# Altium schematic sheet ALTIUM_Sheet_1_2020-07-05_01-04-44.schdoc
size 277 x 198 mm
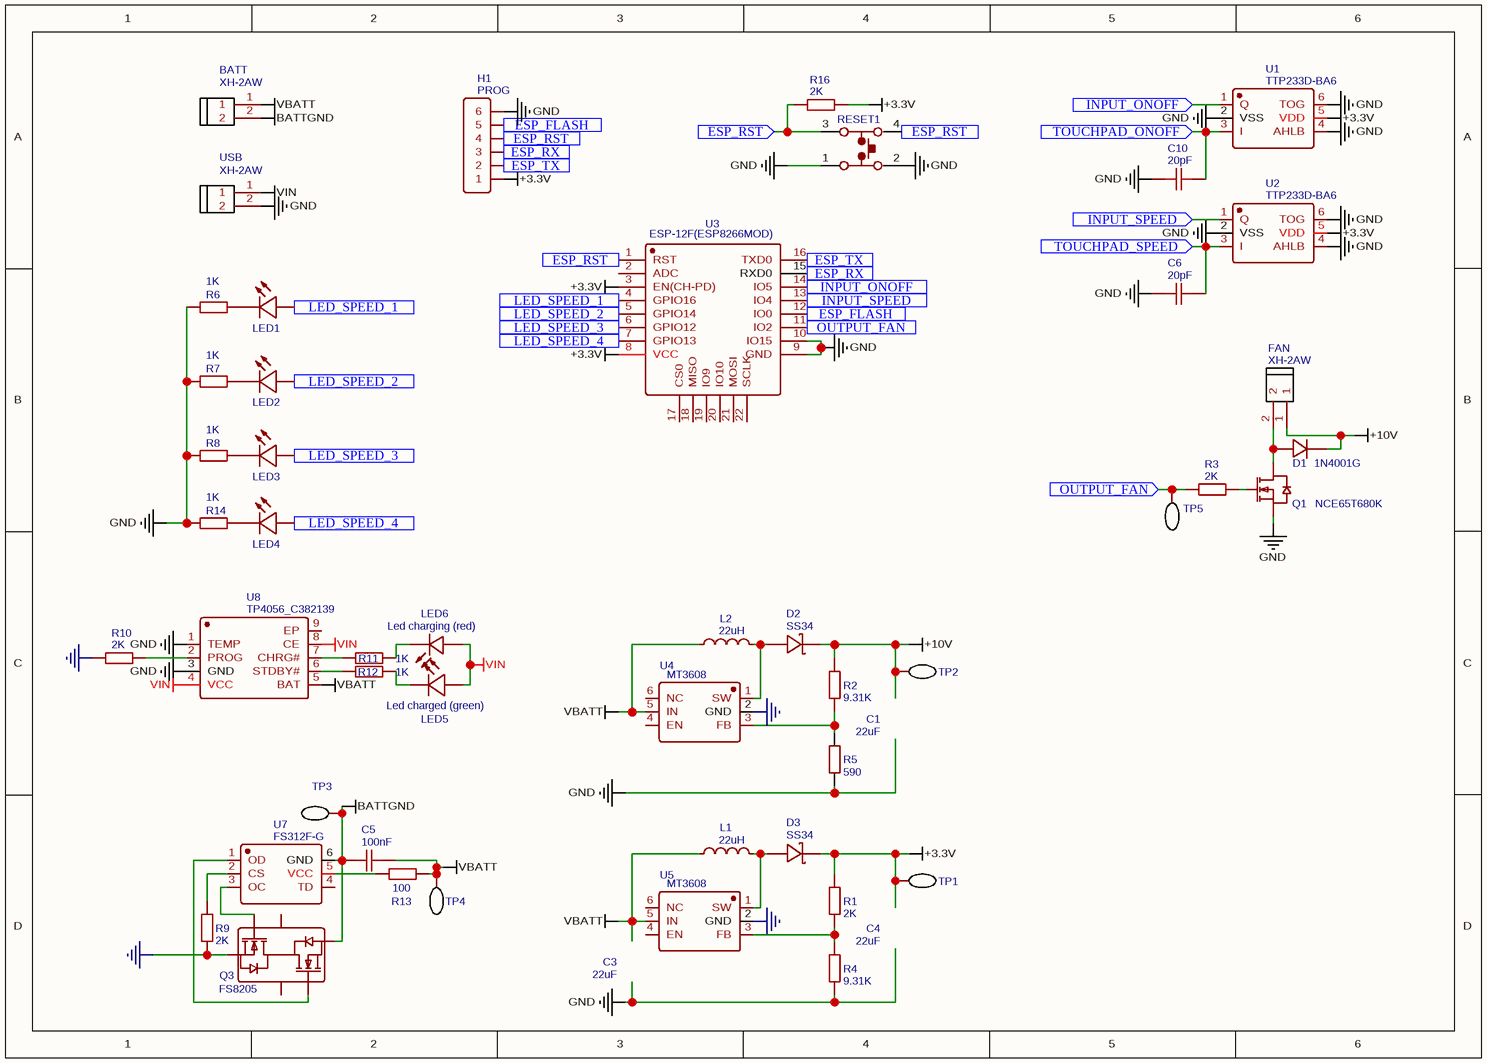
[diagram p0: ALTIUM_Sheet_1_2020-07-05_01-04-44.schdoc]

## Parts
BATT  XH-2AW  [CONN-TH_2P-P2.50_XH-2AW]
C1  22uF  [1812]
C3  22uF  [1812]
C4  22uF  [1812]
C5  100nF  [C0805]
C6  20pF  [C0603]
C10  20pF  [C0603]
D1  1N4001G  [SMA_L4.4-W2.6-LS5.0-RD]
D2  SS34  [SMA(DO-214AC)]
D3  SS34  [SMA(DO-214AC)]
FAN  XH-2AW  [CONN-TH_2P-P2.50_XH-2AW]
H1  PROG  [HDR-TH_6P-P2.54-V]
L1  22uH  [7*7*4]
L2  22uH  [7*7*4]
LED1  Led charged (green)  [LED1206-RD]  (value not drawn)
LED2  Led charged (green)  [LED1206-RD]  (value not drawn)
LED3  Led charged (green)  [LED1206-RD]  (value not drawn)
LED4  Led charged (green)  [LED1206-RD]  (value not drawn)
LED5  Led charged (green)  [LED1206-RD]
LED6  Led charging (red)  [LED1206-R-RD]
Q1  NCE65T680K  [TO-252-2_L6.6-W6.1-P4.57-LS9.9-BR-CW]
Q3  FS8205  [SOT-23-6]
R1  2K  [R0805]
R2  9.31K  [R0805]
R3  2K  [R0805]
R4  9.31K  [R0805]
R5  590  [R0805]
R6  1K  [R0805]
R7  1K  [R0805]
R8  1K  [R0805]
R9  2K  [R0805]
R10  2K  [R0805]
R11  1K  [R0805]
R12  1K  [R0805]
R13  100  [R0805]
R14  1K  [R0805]
R16  2K  [R0805]
RESET1  RESET  [TACTILE SWITCH THT 6X6MM]  (value not drawn)
TP1  TEST_PAD  [TESTPAD0]  (value not drawn)
TP2  TEST_PAD  [TESTPAD0]  (value not drawn)
TP3  TEST_PAD  [TESTPAD0]  (value not drawn)
TP4  TEST_PAD  [TESTPAD0]  (value not drawn)
TP5  TEST_PAD  [TESTPAD0]  (value not drawn)
U1  TTP233D-BA6  [SOT-23-6_L2.9-W1.6-P0.95-LS2.8-BR]
U2  TTP233D-BA6  [SOT-23-6_L2.9-W1.6-P0.95-LS2.8-BR]
U3  ESP-12F(ESP8266MOD)  [WIFIM-SMD_ESP-12F-ESP8266MOD]
U4  MT3608  [SOT-23-6]
U5  MT3608  [SOT-23-6]
U7  FS312F-G  [SOT-23-6_L2.9-W1.6-P0.95-LS2.8-BR]
U8  TP4056_C382139  [ESOP-8_L4.9-W3.9-P1.27-LS6.0-BL-EP]
USB  XH-2AW  [CONN-TH_2P-P2.50_XH-2AW]

## Ports
ESP_FLASH (in), ESP_RST (in), ESP_RX (in), ESP_TX (in), INPUT_ONOFF (in), INPUT_SPEED (in), LED_SPEED_1 (in), LED_SPEED_2 (in), LED_SPEED_3 (in), LED_SPEED_4 (in), OUTPUT_FAN (in), TOUCHPAD_ONOFF (in), TOUCHPAD_SPEED (in)

## Nets
+3.3V: D3.2(K) H1.1 R1.2 R16.1 TP1.1 U1.5(VDD) U2.5(VDD) U3.3(EN(CH-PD)) U3.8(VCC)
+10V: D1.1(C) D2.2(K) FAN.1 R2.2 TP2.1
BATTGND: BATT.2 C5.1 Q3.3(S2) TP3.1 U7.6(GND)
GND: C6.1 C10.1 H1.6 Q1.3(S) Q3.1(S1) R4.1 R5.2 R6.1 R7.1 R8.1 R9.1 R10.1 R14.1 RESET1.1 RESET1.2 U1.2(VSS) U1.4(AHLB) U1.6(TOG) U2.2(VSS) U2.4(AHLB) U2.6(TOG) U3.9(GND) U3.10(IO15) U4.2(GND) U5.2(GND) U8.1(TEMP) U8.3(GND) USB.2
VBATT: BATT.1 C5.2 L1.1 L2.1 R13.1 TP4.1 U4.5(IN) U5.5(IN) U8.5(BAT)
VIN: LED5.2(+) LED6.1(A) U8.4(VCC) U8.8(CE) USB.1
ESP_FLASH: H1.5 U3.12(IO0) ; port ESP_FLASH
ESP_RST: H1.4 R16.2 RESET1.3 RESET1.4 U3.1(RST) ; port ESP_RST
ESP_RX: H1.3 U3.15(RXD0) ; port ESP_RX
ESP_TX: H1.2 U3.16(TXD0) ; port ESP_TX
INPUT_ONOFF: U1.1(Q) U3.14(IO5) ; port INPUT_ONOFF
INPUT_SPEED: U2.1(Q) U3.13(IO4) ; port INPUT_SPEED
LED_SPEED_1: LED1.2(+) U3.4(GPIO16) ; port LED_SPEED_1
LED_SPEED_2: LED2.2(+) U3.5(GPIO14) ; port LED_SPEED_2
LED_SPEED_3: LED3.2(+) U3.6(GPIO12) ; port LED_SPEED_3
LED_SPEED_4: LED4.2(+) U3.7(GPIO13) ; port LED_SPEED_4
OUTPUT_FAN: R3.2 TP5.1 U3.11(IO2) ; port OUTPUT_FAN
TOUCHPAD_ONOFF: C10.2 U1.3(I) ; port TOUCHPAD_ONOFF
TOUCHPAD_SPEED: C6.2 U2.3(I) ; port TOUCHPAD_SPEED
NetD1_2: D1.2(A) FAN.2 Q1.2(D)
NetD2_1: D2.1(A) L2.2 U4.1(SW)
NetD3_1: D3.1(A) L1.2 U5.1(SW)
NetLED1_1: LED1.1(-) R6.2
NetLED2_1: LED2.1(-) R7.2
NetLED3_1: LED3.1(-) R8.2
NetLED4_1: LED4.1(-) R14.2
NetLED5_1: LED5.1(-) R12.2
NetLED6_2: LED6.2(K) R11.2
NetQ1_1: Q1.1(G) R3.1
NetQ3_4: Q3.4(G2) U7.1(OD)
NetQ3_6: Q3.6(G1) U7.3(OC)
NetR1_1: R1.1 R4.2 U5.3(FB)
NetR2_1: R2.1 R5.1 U4.3(FB)
NetR9_2: R9.2 U7.2(CS)
NetR10_2: R10.2 U8.2(PROG)
NetR11_1: R11.1 U8.7(CHRG#)
NetR12_1: R12.1 U8.6(STDBY#)
NetR13_2: R13.2 U7.5(VCC)

Not connected (* = marked no-connect by the designer): Q3 2(D12) 5(D12); U3 2(ADC) 17(CS0) 18(MISO) 19(IO9) 20(IO10) 21(MOSI) 22(SCLK); U4 4(EN) 6(NC); U5 4(EN) 6(NC); U7 4(TD); U8 9(EP)

## Library data of the parts
BATT FAN USB = XH-2AW: BOM_Manufacturer: BOOMELE; BOM_Supplier: LCSC; BOM_Manufacturer Part: XH-2AW; image: //image.lceda.cn/szlcsc/C33132.jpg; BOM_Supplier Part: C33132; spicePre: C; spiceSymbolName: XH-2AW
C1 C3 C4 = 22uF: BOM_Manufacturer: FH; BOM_Manufacturer Part: 1812X226K250NT; Voltage: 25V; Tolerance: ±10%; Value: 22uF; BOM_Supplier: LCSC; spicePre: C; BOM_Supplier Part: C28504
C5 = 100nF: BOM_Manufacturer: MuRata; BOM_Manufacturer Part: GRM21BR72A104KAC4L; nameAlias: Capacitance; BOM_Supplier: LCSC; BOM_Supplier Part: C86044; spicePre: C; spiceSymbolName: GRM21BR72A104KAC4L
C6 C10 = 20pF: BOM_Manufacturer: Walsin Tech Corp; BOM_Manufacturer Part: 0603N200J500; nameAlias: Capacitance; Contributor: LCSC; BOM_Supplier: LCSC; BOM_Supplier Part: C123543; spicePre: C; spiceSymbolName: 0603N200J500
D1 = 1N4001G: BOM_Manufacturer: Shikues; Contributor: LCSC; BOM_Supplier: LCSC; BOM_Supplier Part: C433392; BOM_Manufacturer Part: 1N4001G; spicePre: D; spiceSymbolName: 1N4001G
H1 = PROG: BOM_Manufacturer: BOOMELE; BOM_Manufacturer Part: Header-Male-2.54_1x6; BOM_Supplier: LCSC; BOM_Supplier Part: C37208; spicePre: H; spiceSymbolName: Header-Male-2.54_1x6
L1 L2 = 22uH: BOM_Manufacturer: LCSC; BOM_Manufacturer Part: SMRH74-220MT; Value: 22uH; BOM_Supplier: LCSC; spicePre: L; BOM_Supplier Part: C27442
Q1 = NCE65T680K: BOM_Manufacturer: Wuxi NCE Power Semiconductor; Contributor: LCSC; BOM_Supplier: LCSC; BOM_Supplier Part: C216787; BOM_Manufacturer Part: NCE65T680K; spicePre: Q; spiceSymbolName: NCE65T680K
Q3 = FS8205: BOM_Manufacturer: FORTUNE; BOM_Supplier: LCSC; BOM_Manufacturer Part: FS8205; spicePre: Q; BOM_Supplier Part: C32254
R1 R3 R9 R10 R16 = 2K: BOM_Manufacturer: BOURNS; BOM_Manufacturer Part: CR0805-FX-2001ELF; nameAlias: Resistance (Ohms); Contributor: LCSC; BOM_Supplier: LCSC; BOM_Supplier Part: C203834; spicePre: R; spiceSymbolName: CR0805-FX-2001ELF
R2 R4 = 9.31K: BOM_Manufacturer: Tyohm; BOM_Manufacturer Part: RMC08059.31K1%N; nameAlias: Resistance (Ohms); Contributor: LCSC; BOM_Supplier: LCSC; BOM_Supplier Part: C325873; spicePre: R; spiceSymbolName: RMC08059.31K1%N
R5 = 590: BOM_Manufacturer: LIZ; BOM_Manufacturer Part: CR0805F85900G; nameAlias: Resistance (Ohms); BOM_Supplier: LCSC; BOM_Supplier Part: C101801; spicePre: R; spiceSymbolName: CR0805F85900G
R6-R8 R11 R12 R14 = 1K: BOM_Manufacturer: LIZ Elec; BOM_Manufacturer Part: CR0805J80102G; nameAlias: Resistance (Ohms); Contributor: LCSC; BOM_Supplier: LCSC; BOM_Supplier Part: C328385; spicePre: R; spiceSymbolName: CR0805J80102G
R13 = 100: BOM_Manufacturer: UniOhm; BOM_Manufacturer Part: 080500F1000T5E; nameAlias: Resistance (Ohms); Contributor: LCSC; BOM_Supplier: LCSC; BOM_Supplier Part: C146168; spicePre: R; spiceSymbolName: 080500F1000T5E
RESET1 = RESET: Contributor: CowboyWillT; BOM_Supplier Part: C393938; BOM_Supplier: LCSC; spicePre: K; spiceSymbolName: TACTILE SWITCH 6X6MM 11MM THT
TP1-TP5 = TEST_PAD: BOM_Manufacturer Part: TESTPAD; Contributor: wenjuntijee; spicePre: T; spiceSymbolName: TEST_PAD
U1 U2 = TTP233D-BA6: BOM_Manufacturer: TONTEK; SMT Type: Extend; BOM_Supplier: LCSC; BOM_Manufacturer Part: TTP233D-BA6; BOM_Supplier Part: C82384; BOM_LCSC Assembly: Yes; spicePre: U; spiceSymbolName: TTP233D-BA6
U3 = ESP-12F(ESP8266MOD): BOM_Manufacturer: Ai-Thinker; BOM_Supplier: LCSC; BOM_Manufacturer Part: ESP-12F(ESP8266MOD); BOM_Supplier Part: C82891; spicePre: U; spiceSymbolName: ESP-12F(ESP8266MOD)
U4 U5 = MT3608: BOM_Manufacturer: LCSC; BOM_Supplier: LCSC; BOM_Manufacturer Part: MT3608; spicePre: U; BOM_Supplier Part: C84817
U7 = FS312F-G: BOM_Manufacturer: FORTUNE; SMT Type: Extend; BOM_Supplier: LCSC; BOM_Manufacturer Part: FS312F-G; image: //image.lceda.cn/szlcsc/C82736.jpg; BOM_Supplier Part: C82736; BOM_LCSC Assembly: Yes; spicePre: U; spiceSymbolName: FS312F-G
U8 = TP4056_C382139: BOM_Manufacturer: TPOWER; BOM_Manufacturer Part: TP4056; Contributor: LCSC; SMT Type: Extend; BOM_Supplier: LCSC; BOM_Supplier Part: C382139; BOM_LCSC Assembly: Yes; spicePre: U; spiceSymbolName: TP4056_C382139
D2 D3 = SS34: BOM_Supplier: LCSC; BOM_Manufacturer Part: SS34; spicePre: D; BOM_Supplier Part: C8678
LED1-LED5 = Led charged (green): BOM_Supplier: LCSC; BOM_Supplier Part: C192319; spicePre: L; spiceSymbolName: led Green
LED6 = Led charging (red): BOM_Supplier: LCSC; BOM_Supplier Part: C192318; spicePre: L; spiceSymbolName: KT-1206Red LED